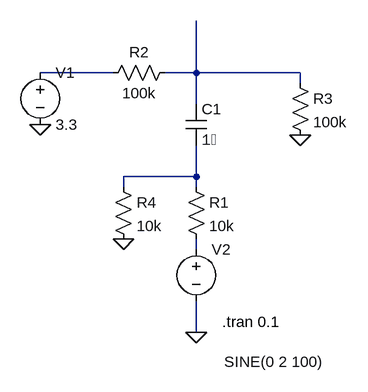
[diagram p0: schematic CurrentSensor.asc]
CurrentSensor.asc, the LTspice schematic file:
Version 4.1
SHEET 1 880 680
WIRE -240 0 -352 0
WIRE -112 0 -112 -80
WIRE -112 0 -160 0
WIRE 48 0 -112 0
WIRE 48 16 48 0
WIRE -112 48 -112 0
WIRE -112 160 -112 112
WIRE -112 160 -224 160
WIRE -224 176 -224 160
WIRE -112 176 -112 160
WIRE -112 272 -112 256
WIRE -112 400 -112 352
FLAG -112 400 0
FLAG 48 96 0
FLAG -352 80 0
FLAG -224 256 0
SYMBOL res -256 16 R270
WINDOW 0 32 56 VTop 2
WINDOW 3 0 56 VBottom 2
SYMATTR InstName R2
SYMATTR Value 100k
SYMBOL res 32 0 R0
SYMATTR InstName R3
SYMATTR Value 100k
SYMBOL voltage -112 256 R0
WINDOW 3 43 189 Left 2
WINDOW 123 0 0 Left 0
WINDOW 39 0 0 Left 0
SYMATTR InstName V2
SYMATTR Value SINE(0 2 100)
SYMBOL voltage -352 -16 R0
WINDOW 123 0 0 Left 0
WINDOW 39 0 0 Left 0
SYMATTR InstName V1
SYMATTR Value 3.3
SYMBOL cap -128 48 R0
SYMATTR InstName C1
SYMATTR Value 1�
SYMBOL res -128 160 R0
SYMATTR InstName R1
SYMATTR Value 10k
SYMBOL res -240 160 R0
SYMATTR InstName R4
SYMATTR Value 10k
TEXT -72 384 Left 2 !.tran 0.1
I_rms_A=0.360893        I_max_A=0.385080        Amp_50Hz=0.001747       Amp_100Hz=0.001689      Amp_150Hz=0.001644      Amp_200Hz=0.001658      Amp_250Hz=0.001513

I_rms_A=0.129979        I_max_A=0.143145        Amp_50Hz=0.000707       Amp_100Hz=0.000771      Amp_150Hz=0.000754      Amp_200Hz=0.000796      Amp_250Hz=0.000899

The netlist it stands for:
* CurrentSensor.asc
R2 N001 N002 100k
R3 N002 0 100k
V2 N004 0 SINE(0 2 100)
V1 N001 0 3.3
C1 N002 N003 1�
R1 N003 N004 10k
R4 N003 0 10k
.tran 0.1
.backanno
.end